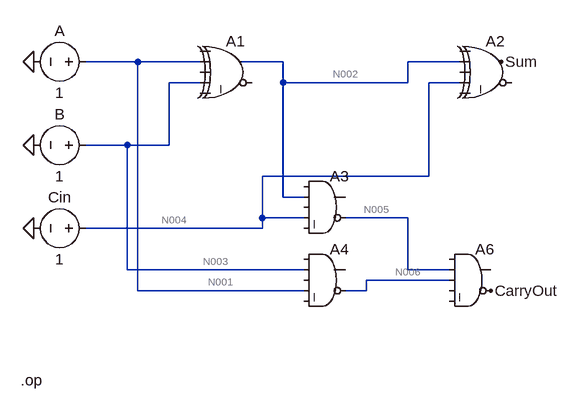
[diagram p0: schematic FullAdder.asc]
FullAdder.asc, the LTspice schematic file:
Version 4
SHEET 1 880 680
WIRE -128 -128 -208 -128
WIRE -32 -128 -128 -128
WIRE 96 -128 32 -128
WIRE 368 -128 288 -128
WIRE -32 -96 -80 -96
WIRE 96 -96 96 -128
WIRE 288 -96 288 -128
WIRE 288 -96 96 -96
WIRE 368 -96 320 -96
WIRE -144 0 -208 0
WIRE -80 0 -80 -96
WIRE -80 0 -144 0
WIRE 320 48 320 -96
WIRE 320 48 64 48
WIRE 96 80 96 -96
WIRE 128 80 96 80
WIRE 64 112 64 48
WIRE 128 112 64 112
WIRE 288 112 192 112
WIRE 64 128 64 112
WIRE 64 128 -208 128
WIRE -144 192 -144 0
WIRE 128 192 -144 192
WIRE 288 192 288 112
WIRE 352 192 288 192
WIRE 352 208 224 208
WIRE -128 224 -128 -128
WIRE 128 224 -128 224
WIRE 224 224 224 208
WIRE 224 224 192 224
FLAG -288 -128 0
FLAG -288 128 0
FLAG -288 0 0
FLAG 416 224 CarryOut
FLAG 432 -128 Sum
SYMBOL Digital\\xor 16 -176 R0
SYMATTR InstName A1
SYMBOL Digital\\xor 416 -176 R0
SYMATTR InstName A2
SYMBOL Digital\\and 160 32 R0
SYMATTR InstName A3
SYMBOL Digital\\and 160 144 R0
SYMATTR InstName A4
SYMBOL Digital\\and 384 144 R0
SYMATTR InstName A6
SYMBOL voltage -192 -128 R90
WINDOW 0 -32 56 VBottom 2
WINDOW 3 32 56 VTop 2
WINDOW 123 0 0 Left 0
WINDOW 39 0 0 Left 0
SYMATTR InstName A
SYMATTR Value 1
SYMBOL voltage -192 0 R90
WINDOW 0 -32 56 VBottom 2
WINDOW 3 32 56 VTop 2
WINDOW 123 0 0 Left 0
WINDOW 39 0 0 Left 0
SYMATTR InstName B
SYMATTR Value 1
SYMBOL voltage -192 128 R90
WINDOW 0 -32 56 VBottom 2
WINDOW 3 32 56 VTop 2
WINDOW 123 0 0 Left 0
WINDOW 39 0 0 Left 0
SYMATTR InstName Cin
SYMATTR Value 1
TEXT -308 362 Left 2 !.op

The netlist it stands for:
* FullAdder.asc
A1 0 N001 0 N003 0 0 N002 0 XOR
A2 0 N002 0 N004 0 0 Sum 0 XOR
A3 0 N002 0 N004 0 N005 0 0 AND
A4 0 N003 0 N001 0 N006 0 0 AND
A6 0 N005 N006 0 0 CarryOut 0 0 AND
V§A N001 0 1
V§B N003 0 1
V§Cin N004 0 1
.op
.backanno
.end

* Results of the author's LTspice run, read from the files saved beside the schematic
* Operating Point:
*   V(n001) = 1 V
*   V(n003) = 1 V
*   V(n002) = 0 V
*   V(n004) = 1 V
*   V(sum) = 1 V
*   V(n005) = 1 V
*   V(n006) = 0 V
*   V(carryout) = 1 V
*   I(Cin) = 0 A
*   I(B) = 0 A
*   I(A) = 0 A
*   I8(A6) = 0 A
*   I6(A6) = 0 A
*   I8(A4) = 0 A
*   I6(A4) = 0 A
*   I8(A3) = 0 A
*   I6(A3) = 0 A
*   I8(A2) = 0 A
*   I7(A2) = 0 A
*   I8(A1) = 0 A
*   I7(A1) = 0 A